# EAGLE design Clock_Updated_3_board2 (EAGLE 7.1.0)
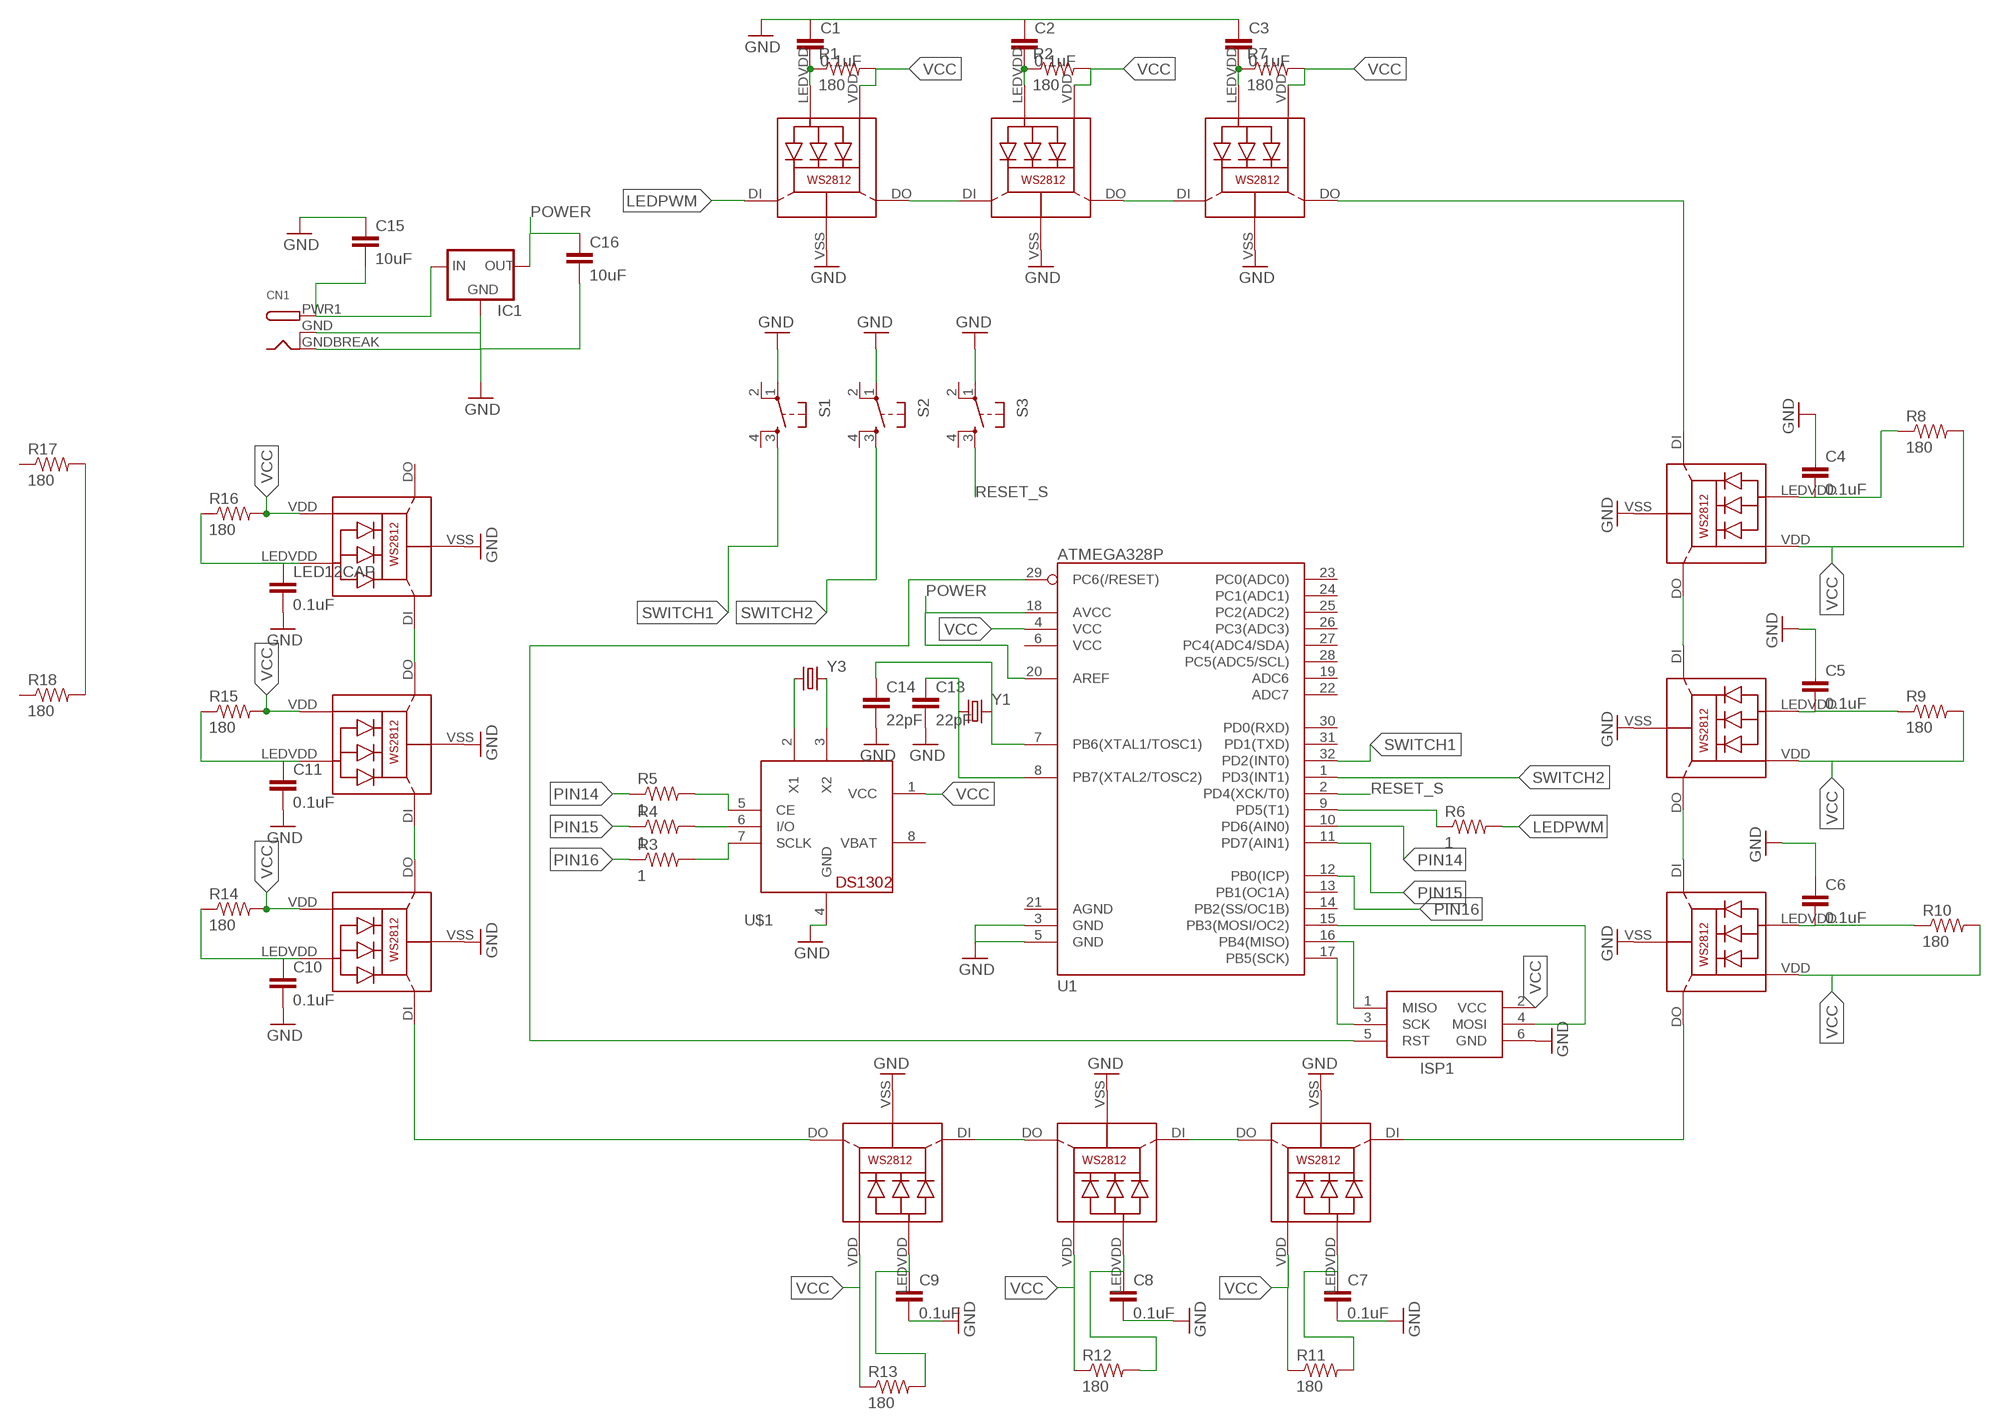
[diagram p0: schematic, sheet 1]

## Parts
C1  0.1uF  0.1UF-25V(+80/-20%)(0603)  [0603-CAP]
C2  0.1uF  0.1UF-25V(+80/-20%)(0603)  [0603-CAP]
C3  0.1uF  0.1UF-25V(+80/-20%)(0603)  [0603-CAP]
C4  0.1uF  0.1UF-25V(+80/-20%)(0603)  [0603-CAP]
C5  0.1uF  0.1UF-25V(+80/-20%)(0603)  [0603-CAP]
C6  0.1uF  0.1UF-25V(+80/-20%)(0603)  [0603-CAP]
C7  0.1uF  0.1UF-25V(+80/-20%)(0603)  [0603-CAP]
C8  0.1uF  0.1UF-25V(+80/-20%)(0603)  [0603-CAP]
C9  0.1uF  0.1UF-25V(+80/-20%)(0603)  [0603-CAP]
C10  0.1uF  0.1UF-25V(+80/-20%)(0603)  [0603-CAP]
C11  0.1uF  0.1UF-25V(+80/-20%)(0603)  [0603-CAP]
C13  22pF  22PF-50V-5%(0603)  [0603-CAP]
C14  22pF  22PF-50V-5%(0603)  [0603-CAP]
C15  10uF  10UF-6.3V-20%(1206)  [1206]
C16  10uF  10UF-6.3V-20%(1206)  [1206]
CN1  DCBARRELSMT  [DCJACK_2MM_SMT]
IC1  V_REG_78XX-TO-220  [TO-220-ALT]
ISP1  AVRISP-6  [AVRISP]
LED1  WS2812  [WS2812]
LED2  WS2812  [WS2812]
LED3  WS2812  [WS2812]
LED4  WS2812  [WS2812]
LED5  WS2812  [WS2812]
LED6  WS2812  [WS2812]
LED7  WS2812  [WS2812]
LED8  WS2812  [WS2812]
LED9  WS2812  [WS2812]
LED10  WS2812  [WS2812]
LED11  WS2812  [WS2812]
LED12  WS2812  [WS2812]
LED12CAP  0.1uF  0.1UF-25V(+80/-20%)(0603)  [0603-CAP]
R1  180  180OHM1/10W1%(0603)  [0603-RES]
R2  180  180OHM1/10W1%(0603)  [0603-RES]
R3  1  1OHM1/10W1%(0603)  [0603-RES]
R4  1  1OHM1/10W1%(0603)  [0603-RES]
R5  1  1OHM1/10W1%(0603)  [0603-RES]
R6  1  1OHM1/10W1%(0603)  [0603-RES]
R7  180  180OHM1/10W1%(0603)  [0603-RES]
R8  180  180OHM1/10W1%(0603)  [0603-RES]
R9  180  180OHM1/10W1%(0603)  [0603-RES]
R10  180  180OHM1/10W1%(0603)  [0603-RES]
R11  180  180OHM1/10W1%(0603)  [0603-RES]
R12  180  180OHM1/10W1%(0603)  [0603-RES]
R13  180  180OHM1/10W1%(0603)  [0603-RES]
R14  180  180OHM1/10W1%(0603)  [0603-RES]
R15  180  180OHM1/10W1%(0603)  [0603-RES]
R16  180  180OHM1/10W1%(0603)  [0603-RES]
R17  180  180OHM1/10W1%(0603)  [0603-RES]
R18  180  180OHM1/10W1%(0603)  [0603-RES]
S1  TAC_SWITCHPTH  [TACTILE-PTH]
S2  TAC_SWITCHPTH  [TACTILE-PTH]
S3  TAC_SWITCHPTH  [TACTILE-PTH]
U1  ATMEGA328P  ATMEGA328_SMT  [TQFP32-08]
U$1  DS1302  [DIL08-ROUND]
Y1  CRYSTALSMD  [HC49UP]
Y3  CRYSTAL32-SMD  [CRYSTAL-32KHZ-SMD]

## Nets
GND: C1.1 C3.1 C6.1 C7.2 C8.2 C9.2 C10.2 C11.2 C13.2 C14.2 C15.1 C16.2 CN1.GND(GNDBREAK) CN1.GNDBREAK(GND) IC1.GND ISP1.6(GND) LED1.VSS(GND) LED2.VSS(GND) LED3.VSS(GND) LED4.VSS(GND) LED5.VSS(GND) LED6.VSS(GND) LED7.VSS(GND) LED8.VSS(GND) LED9.VSS(GND) LED10.VSS(GND) LED11.VSS(GND) LED12.VSS(GND) LED12CAP.2 S1.1 S2.1 S3.1 U1.3(GND) U1.5(GND) U$1.4(GND)
LEDPWM: LED1.DI R6.2
N$1: R6.1 U1.9(PD5(T1))
N$2: C4.2 LED5.LEDVDD R8.1
N$3: C5.2 LED6.LEDVDD R9.1
N$4: C6.2 LED7.LEDVDD R10.1
N$5: LED9.DO LED10.DI
N$6: LED10.DO LED11.DI
N$7: U$1.3(X2) Y3.X2
N$8: U$1.2(X1) Y3.X1
N$9: R3.2 U$1.7(SCLK)
N$10: R4.2 U$1.6(I/O)
N$11: R5.2 U$1.5(CE)
N$12: LED4.DI LED11.DO
N$13: LED6.VDD R9.2
N$14: LED8.DO LED12.DI
N$15: C7.1 LED9.LEDVDD R11.2
N$16: LED6.DO LED7.DI
N$17: LED3.DO LED5.DI
N$18: LED5.DO LED6.DI
N$19: LED1.DO LED2.DI
N$20: LED2.DO LED3.DI
N$21: C8.1 LED10.LEDVDD
N$22: LED4.DO LED8.DI
N$23: C9.1 LED11.LEDVDD R13.2
N$24: LED12.LEDVDD R16.1
N$25: LED7.DO LED9.DI
N$26: R12.2
N$27: LED4.LEDVDD R14.1
N$28: ISP1.4(MOSI) U1.15(PB3(MOSI/OC2))
N$29: LED8.LEDVDD R15.1
N$30: C1.2 LED1.LEDVDD R1.1
N$31: C2.2 LED2.LEDVDD R2.1
N$32: C3.2 LED3.LEDVDD R7.1
N$33: ISP1.1(MISO) U1.16(PB4(MISO))
N$34: ISP1.3(SCK) U1.17(PB5(SCK))
N$35: ISP1.5(RST) U1.29(PC6(/RESET))
N$36: C15.2 CN1.PWR1(PWR) IC1.IN
N$37: R17.2 R18.2
N$38: C13.1 U1.8(PB7(XTAL2/TOSC2)) Y1.1
N$39: C14.1 U1.7(PB6(XTAL1/TOSC1)) Y1.2
PIN14: R5.1 U1.10(PD6(AIN0))
PIN15: R4.1 U1.11(PD7(AIN1))
PIN16: R3.1 U1.12(PB0(ICP))
POWER: C16.1 IC1.OUT U1.18(AVCC) U1.20(AREF)
RESET_S: S3.3 U1.2(PD4(XCK/T0))
SWITCH1: S1.3 U1.32(PD2(INT0))
SWITCH2: S2.3 U1.1(PD3(INT1))
VCC: LED1.VDD LED2.VDD LED3.VDD LED4.VDD LED5.VDD LED7.VDD LED8.VDD LED9.VDD LED10.VDD LED11.VDD LED12.VDD R8.2 R10.2 R11.1 R12.1 R13.1 R14.2 R15.2 R16.2 U1.4(VCC) U$1.1(VCC)
Unconnected: C2.1 C4.1 C5.1 C10.1 C11.1 LED12.DO LED12CAP.1 R1.2 R2.2 R7.2 R17.1 R18.1 S1.2 S1.4 S2.2 S2.4 S3.2 S3.4 U1.6(VCC) U1.13(PB1(OC1A)) U1.14(PB2(SS/OC1B)) U1.19(ADC6) U1.21(AGND) U1.22(ADC7) U1.23(PC0(ADC0)) U1.24(PC1(ADC1)) U1.25(PC2(ADC2)) U1.26(PC3(ADC3)) U1.27(PC4(ADC4/SDA)) U1.28(PC5(ADC5/SCL)) U1.30(PD0(RXD)) U1.31(PD1(TXD))

## Power pins joined to a net without a drawn wire
VBAT: U$1.8(VBAT)
VCC: ISP1.2(VCC)

## Library data of the parts
C1-C11 LED12CAP = SparkFun-Capacitors:0.1UF-25V(+80/-20%)(0603): CAP-00810 Ceramic Standard decoupling cap; PROD_ID: CAP-00810
C13 C14 = SparkFun-Capacitors:22PF-50V-5%(0603): CAP-07876; PROD_ID: CAP-07876
C15 C16 = SparkFun-Capacitors:10UF-6.3V-20%(1206): CAP-10057 Ceramic; PROD_ID: CAP-10057
CN1 = adafruit:DCBARREL: 2.0mm DC Barrel Jack DCJACK_2MM_PTH - Through Hole Jack (4UConnector: 05537)
IC1 = SparkFun-PowerIC:V_REG_78XX: Voltage Regulator Standard 7805 5V regulator. IGO (Input Ground Output). Spark Fun Electronics SKU : COM-00107
ISP1 = adafruit:AVRISP: AVR ISP HEADER Standard 6 pin header for AVR programming
LED1-LED12 = adafruit:WS2812
R1 R2 R7-R18 = SparkFun-Resistors:180OHM1/10W1%(0603): RES-08788; PROD_ID: RES-08788
R3-R6 = SparkFun-Resistors:1OHM1/10W1%(0603): RES-08269; PROD_ID: RES-08269
S1-S3 = SparkFun-Electromechanical:TAC_SWITCH: Momentary Switch Button commonly used for reset or general input. Spark Fun Electronics SKU : COM-00097 SMT- SWCH-08247
U1 = SparkFun-DigitalIC:ATMEGA328_SMT: 32-Pin Atmega328 part Commonly used on Arduino compatible boards Available in QFP and QFN packages TQFP is IC-09069 QFN is non-stock; PROD_ID: IC-09069
U$1 = adafruit:DS1302: DS1302 - Real time clock with supercap trickle charger
Y1 = SparkFun-FreqCtrl:CRYSTAL: Various standard crystals. Proven footprints. Spark Fun Electronics SKU : COM-00534
Y3 = SparkFun-FreqCtrl:CRYSTAL: Various standard crystals. Proven footprints. Spark Fun Electronics SKU : COM-00534; PROD_ID: XTAL-07894

## Board
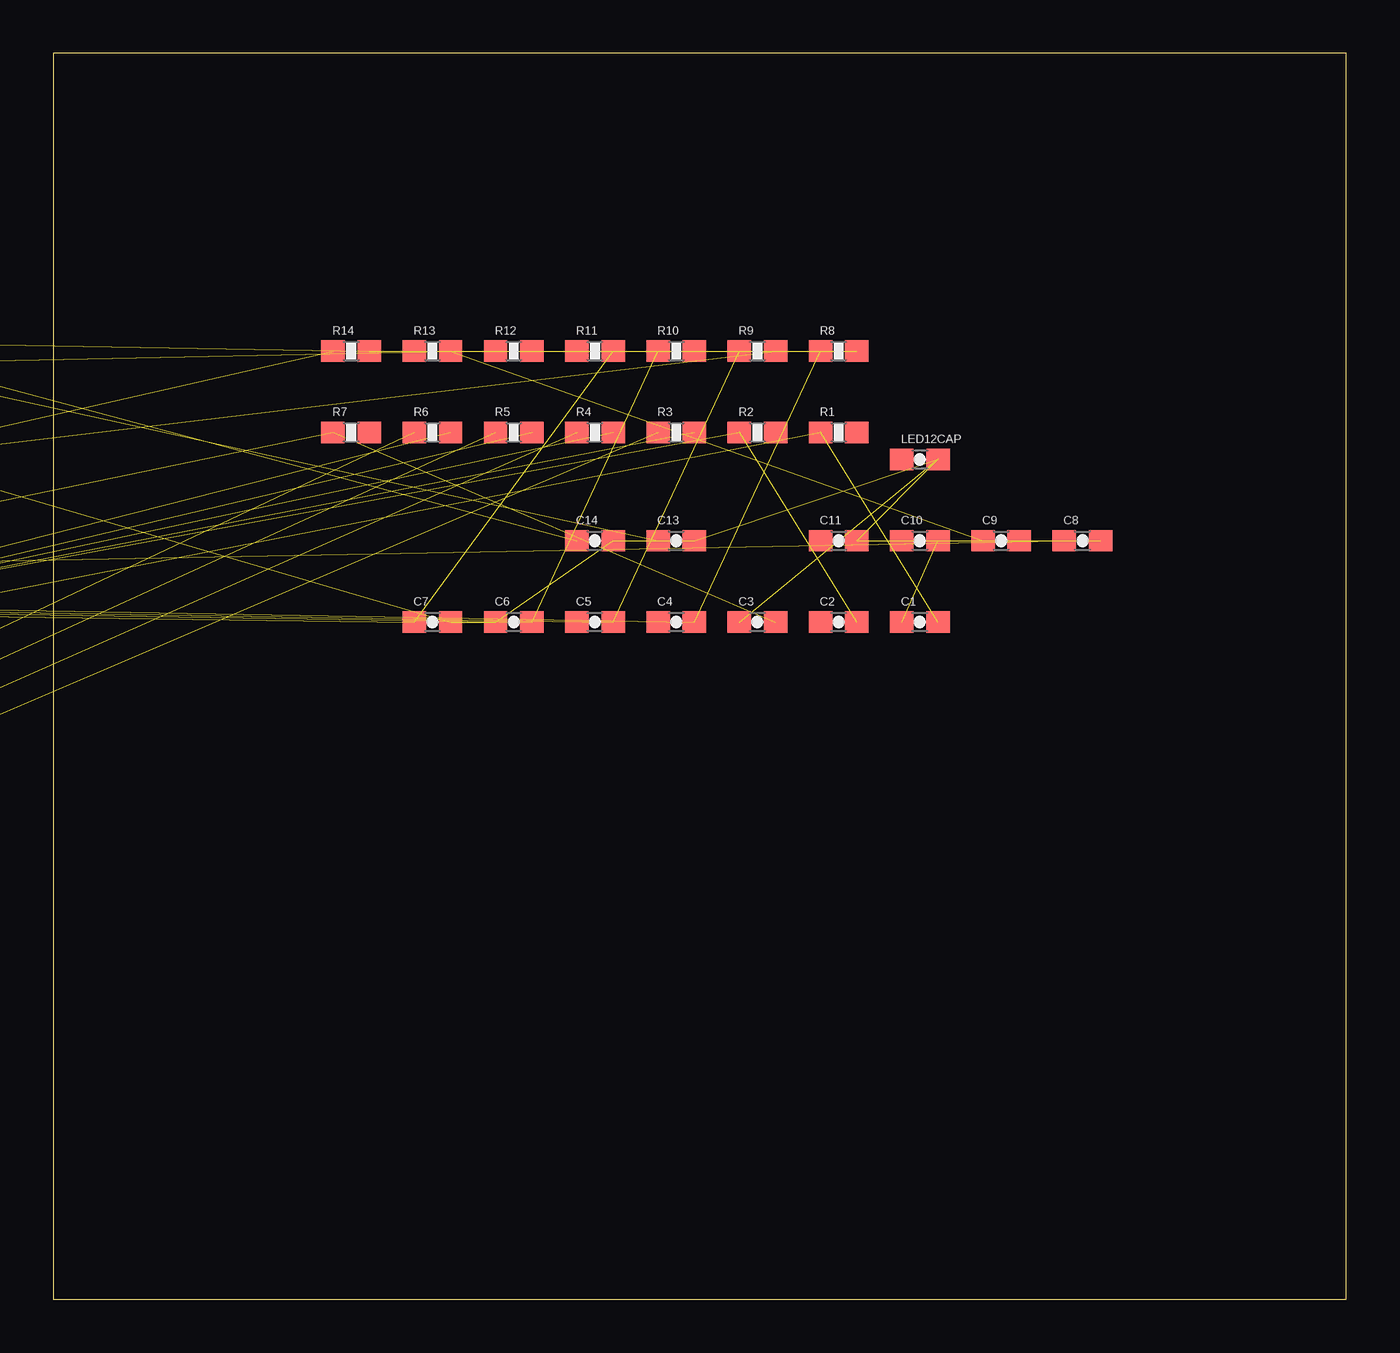
[diagram p1: board, top side]
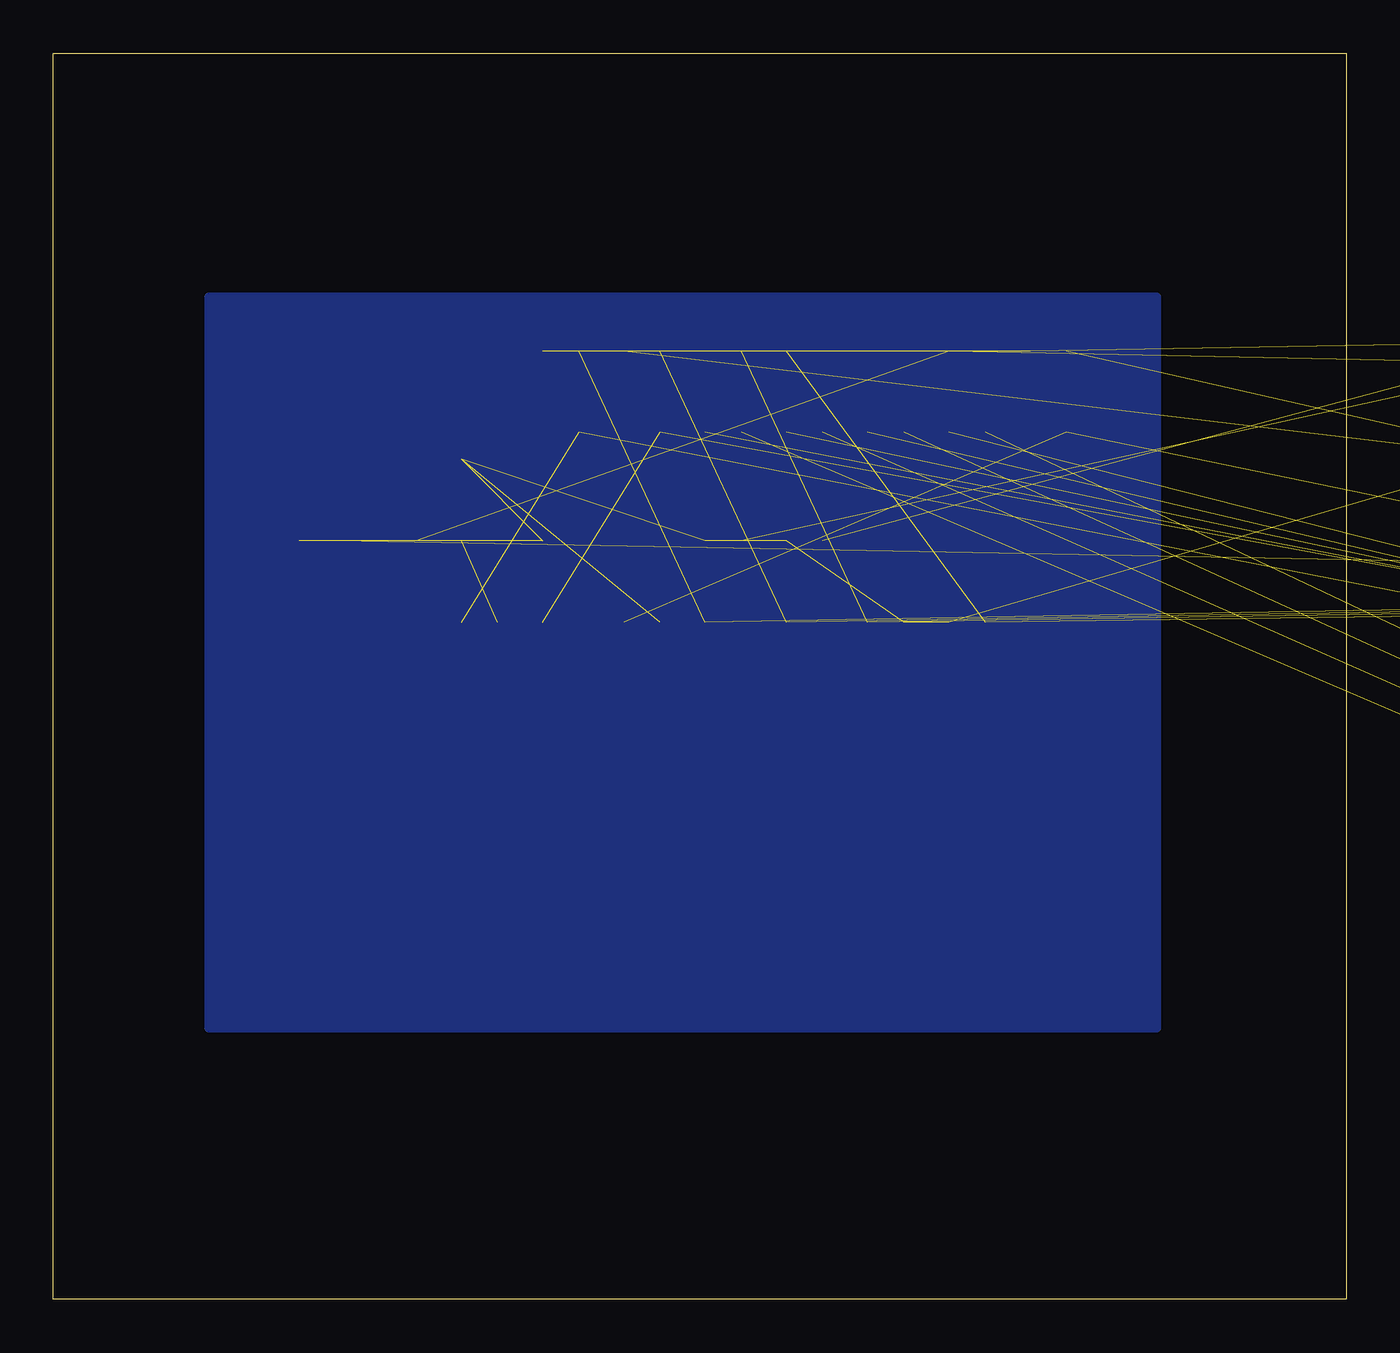
[diagram p2: board, bottom side, seen from below]

Size 60.63 x 58.41 mm. Coordinates in mm from the lower left corner, seen from the top.
Outline: 0,0 60.63,0 60.63,58.41 0,58.41 0,0
Copper layers (1*16): Top 0.035mm / dielectric 1.5mm / Bottom 0.035mm
Design rules "default": minimum track width 10mil, minimum drill 24mil, track to track 8mil, track to pad 8mil, pad to pad 8mil, via to via 8mil, smd to smd 8mil, copper to edge 40mil, drill to drill 8mil, minimum pad ring 10mil, minimum via ring 8mil, stop-mask expansion 4mil, vias tented up to drill 0mil, thermal gap 10mil

### Footprints (pad centres in the part's own frame; a part is rotated, then mirrored left to right if it is on the bottom)
0603-CAP = smd 1.1 x 1: 1 -0.85,0; 2 0.85,0
1206 = smd 1.6 x 1.8: 1 -1.4,0; 2 1.4,0
DCJACK_2MM_SMT = smd 2.4 x 2: GND 0,-5.5; GNDBREAK 6.2,-5.5; PWR1 0,5.5; PWR2 6.2,5.5 | hole 1.6: 0,0 | hole 1.8: 4.5,0
TO-220-ALT = drill 1.016 long: GND 0,-3.81; IN -2.54,-3.81; OUT 2.54,-3.81 | hole 3.302: 0,11.176
AVRISP = drill 0.9 pad 1.626: 1 -1.27,2.54; 2 1.27,2.54; 3 -1.27,0; 4 1.27,0; 5 -1.27,-2.54; 6 1.27,-2.54
WS2812 = smd 2 x 1.1: DI 2,0; DO 2,-1.7; LEDVDD -2,0; NC -2,1.7; VDD 2,1.7; VSS -2,-1.7
0603-RES = smd 1.1 x 1: 1 -0.85,0; 2 0.85,0
TACTILE-PTH = drill 1.016 pad 1.88: 1 -3.251,2.261; 2 3.251,2.261; 3 -3.251,-2.261; 4 3.251,-2.261
TQFP32-08 = smd 1.27 x 0.559: 1 -4.293,2.8; 2 -4.293,2; 3 -4.293,1.2; 4 -4.293,0.4; 5 -4.293,-0.4; 6 -4.293,-1.2; 7 -4.293,-2; 8 -4.293,-2.8; 17 4.293,-2.8; 18 4.293,-2; 19 4.293,-1.2; 20 4.293,-0.4; 21 4.293,0.4; 22 4.293,1.2; 23 4.293,2; 24 4.293,2.8 | smd 0.559 x 1.27: 9 -2.8,-4.293; 10 -2,-4.293; 11 -1.2,-4.293; 12 -0.4,-4.293; 13 0.4,-4.293; 14 1.2,-4.293; 15 2,-4.293; 16 2.8,-4.293; 25 2.8,4.293; 26 2,4.293; 27 1.2,4.293; 28 0.4,4.293; 29 -0.4,4.293; 30 -1.2,4.293; 31 -2,4.293; 32 -2.8,4.293
DIL08-ROUND = drill 0.813 pad 1.676: 1 -3.81,-3.81; 2 -1.27,-3.81; 3 1.27,-3.81; 4 3.81,-3.81; 5 3.81,3.81; 6 1.27,3.81; 7 -1.27,3.81; 8 -3.81,3.81
HC49UP = smd 5.334 x 1.93: 1 -4.826,0; 2 4.826,0
CRYSTAL-32KHZ-SMD = smd 2.5 x 6: SHEILD 0,5.08 | smd 1 x 2.5: X1 -1.27,0; X2 1.27,0

### Placement (x,y rotation side)
C1  40.64,31.75 0 top
C2  36.83,31.75 0 top
C3  33.02,31.75 0 top
C4  29.21,31.75 0 top
C5  25.4,31.75 0 top
C6  21.59,31.75 0 top
C7  17.78,31.75 0 top
C8  48.26,35.56 0 top
C9  44.45,35.56 0 top
C10  40.64,35.56 0 top
C11  36.83,35.56 0 top
C13  29.21,35.56 0 top
C14  25.4,35.56 0 top
C15  -52.07,50.8 0 top  (outside the outline)
C16  -57.15,50.8 0 top  (outside the outline)
CN1  -57.15,3.81 0 top  (outside the outline)
IC1  -40.64,2.54 0 top  (outside the outline)
ISP1  -82.55,41.91 0 top  (outside the outline)
LED1  -53.34,22.86 0 top  (outside the outline)
LED2  -62.23,22.86 0 top  (outside the outline)
LED3  -71.12,22.86 0 top  (outside the outline)
LED4  -80.01,22.86 0 top  (outside the outline)
LED5  -40.64,33.02 0 top  (outside the outline)
LED6  -49.53,33.02 0 top  (outside the outline)
LED7  -58.42,33.02 0 top  (outside the outline)
LED8  -12.7,43.18 0 top  (outside the outline)
LED9  -76.2,33.02 0 top  (outside the outline)
LED10  -85.09,33.02 0 top  (outside the outline)
LED11  -40.64,43.18 0 top  (outside the outline)
LED12  -49.53,43.18 0 top  (outside the outline)
LED12CAP  40.64,39.37 0 top
R1  36.83,40.64 0 top
R2  33.02,40.64 0 top
R3  29.21,40.64 0 top
R4  25.4,40.64 0 top
R5  21.59,40.64 0 top
R6  17.78,40.64 0 top
R7  13.97,40.64 0 top
R8  36.83,44.45 0 top
R9  33.02,44.45 0 top
R10  29.21,44.45 0 top
R11  25.4,44.45 0 top
R12  21.59,44.45 0 top
R13  17.78,44.45 0 top
R14  13.97,44.45 0 top
R15  -13.97,50.8 0 top  (outside the outline)
R16  -13.97,53.34 180 top  (outside the outline)
R17  -86.36,-5.08 0 top  (outside the outline)
R18  -86.36,-8.89 0 top  (outside the outline)
S1  -57.15,41.91 0 top  (outside the outline)
S2  -66.04,41.91 0 top  (outside the outline)
S3  -74.93,41.91 0 top  (outside the outline)
U1  -67.31,3.81 0 top  (outside the outline)
U$1  -40.64,22.86 0 top  (outside the outline)
Y1  -41.91,52.07 0 top  (outside the outline)
Y3  -74.93,-1.27 0 top  (outside the outline)

### Tracks (layer width: path | path; a pad name or v marks a point on that pad's centre or on a via)
GND  (34 unrouted)
LEDPWM  (1 unrouted)
N$1  (1 unrouted)
N$2  (2 unrouted)
N$3  (2 unrouted)
N$4  (2 unrouted)
N$5  (1 unrouted)
N$6  (1 unrouted)
N$7  (1 unrouted)
N$8  (1 unrouted)
N$9  (1 unrouted)
N$10  (1 unrouted)
N$11  (1 unrouted)
N$12  (1 unrouted)
N$13  (1 unrouted)
N$14  (1 unrouted)
N$15  (2 unrouted)
N$16  (1 unrouted)
N$17  (1 unrouted)
N$18  (1 unrouted)
N$19  (1 unrouted)
N$20  (1 unrouted)
N$21  (1 unrouted)
N$22  (1 unrouted)
N$23  (2 unrouted)
N$24  (1 unrouted)
N$25  (1 unrouted)
N$27  (1 unrouted)
N$28  (1 unrouted)
N$29  (1 unrouted)
N$30  (2 unrouted)
N$31  (2 unrouted)
N$32  (2 unrouted)
N$33  (1 unrouted)
N$34  (1 unrouted)
N$35  (1 unrouted)
N$36  (2 unrouted)
N$37  (1 unrouted)
N$38  (2 unrouted)
N$39  (2 unrouted)
PIN14  (1 unrouted)
PIN15  (1 unrouted)
PIN16  (1 unrouted)
POWER  (3 unrouted)
RESET_S  (1 unrouted)
SWITCH1  (1 unrouted)
SWITCH2  (1 unrouted)
VCC  (21 unrouted)
  pour Bottom: 8.89,46.99 53.34,46.99 53.34,12.7 8.89,12.7